# Altium schematic sheet Flex.SchDoc
size 431 x 279 mm; Organization: ORGANIZATION; Address1: ADDRESS 1; Address2: ADDRESS 2; Address3: ADDRESS 3; Address4: ADDRESS 4; Revision: -; ENG_APP_DATE: --/--/--; DSN_APP_DATE: --/--/--; CHK_APP_DATE: --/--/--
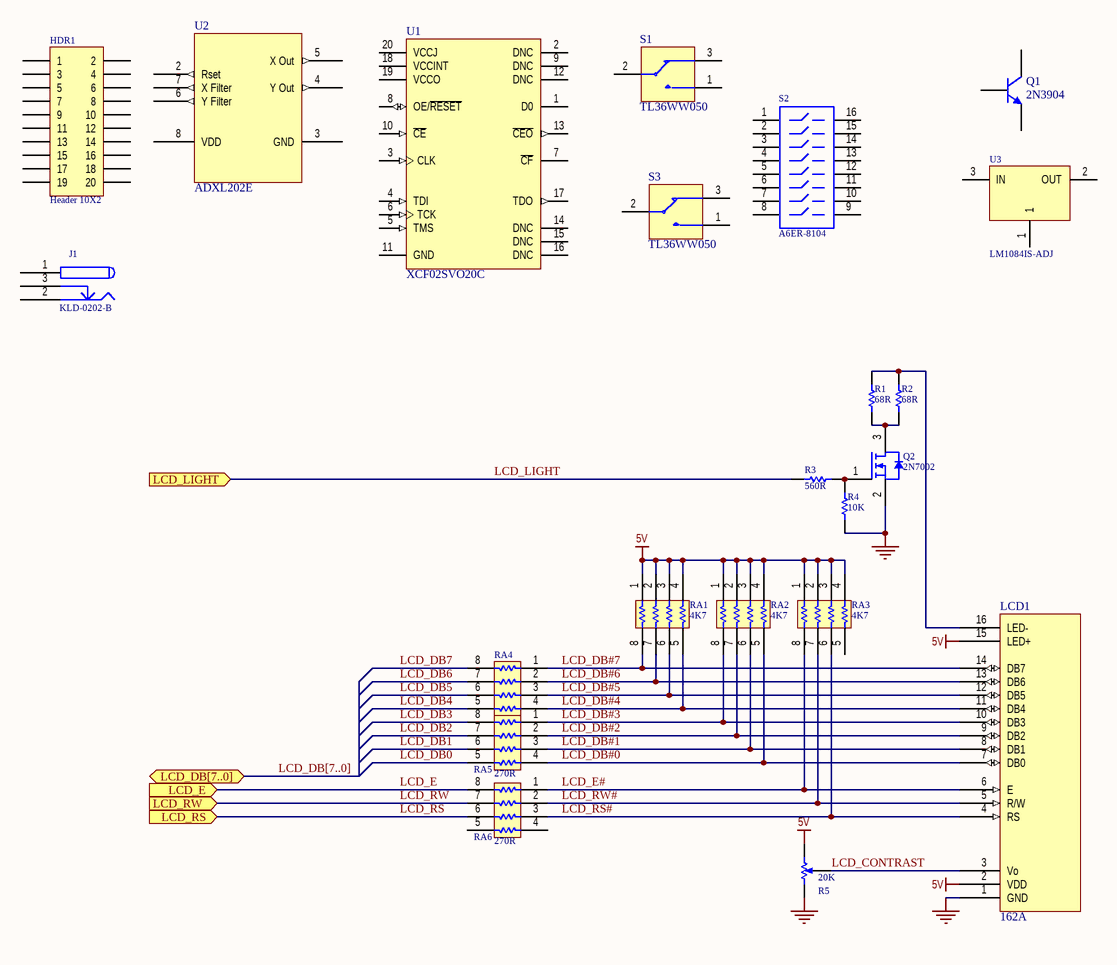
[diagram p0: Flex.SchDoc]

## Parts
HDR1  Header 10X2  [HDR2X10]
J1  KLD-0202-B  [KLD-0202]
LCD1  162A  [162A]
Q1  2N3904  [TO-92A]
Q2  2N7002  [SO-G3]
R1  68R  [CC2012-0805]
R2  68R  [CC2012-0805]
R3  560R  [CC2012-0805]
R4  10K  [CR2012-0805]
R5  20K  [POT4MM-2]
RA1  4K7  [MNR34T]
RA2  4K7  [MNR34T]
RA3  4K7  [MNR34T]
RA4  270R  [MNR34]
RA5  270R  [MNR34]
RA6  270R  [MNR34]
S1  TL36WW050  [PCB_SWITCH]
S2  A6ER-8104  [DIP-16-KEY]
S3  TL36WW050  [PCB_SWITCH]
U1  XCF02SVO20C  [VO20]
U2  ADXL202E  [E-8]
U3  LM1084IS-ADJ  [TO-263]

## Ports
LCD_DB[7..0] (bidir), LCD_E (in), LCD_LIGHT (in), LCD_RS (in), LCD_RW (in)

## Nets
5V: LCD1.2(VDD) LCD1.15(LED+) R5.CW(+) RA1.1 RA1.2 RA1.3 RA1.4 RA2.1 RA2.2 RA2.3 RA2.4 RA3.1 RA3.2 RA3.3 RA3.4
GND: LCD1.1(GND) Q2.2 R4.1 R5.CCW(-)
LCD_CONTRAST: LCD1.3(Vo) R5.W
LCD_DB0: RA5.5
LCD_DB1: RA5.6
LCD_DB2: RA5.7
LCD_DB3: RA5.8
LCD_DB4: RA4.5
LCD_DB5: RA4.6
LCD_DB6: RA4.7
LCD_DB7: RA4.8
LCD_DB#0: LCD1.7(DB0) RA2.5 RA5.4
LCD_DB#1: LCD1.8(DB1) RA2.6 RA5.3
LCD_DB#2: LCD1.9(DB2) RA2.7 RA5.2
LCD_DB#3: LCD1.10(DB3) RA2.8 RA5.1
LCD_DB#4: LCD1.11(DB4) RA1.5 RA4.4
LCD_DB#5: LCD1.12(DB5) RA1.6 RA4.3
LCD_DB#6: LCD1.13(DB6) RA1.7 RA4.2
LCD_DB#7: LCD1.14(DB7) RA1.8 RA4.1
LCD_E: RA6.8 ; port LCD_E
LCD_E#: LCD1.6(E) RA3.8 RA6.1
LCD_LIGHT: R3.1 ; port LCD_LIGHT
LCD_RS: RA6.6 ; port LCD_RS
LCD_RS#: LCD1.4(RS) RA3.6 RA6.3
LCD_RW: RA6.7 ; port LCD_RW
LCD_RW#: LCD1.5(R/W) RA3.7 RA6.2
NetLCD1_16: LCD1.16(LED-) R1.1 R2.1
NetQ2_1: Q2.1 R3.2 R4.2
NetQ2_3: Q2.3 R1.2 R2.2

Not connected (* = marked no-connect by the designer): HDR1 1 2 3 4 5 6 7 8 9 10 11 12 13 14 15 16 17 18 19 20; J1 1 2 3; Q1 1(E) 2(B) 3(C); RA3 5; RA6 4 5; S1 1 2 3; S2 1 2 3 4 5 6 7 8 9 10 11 12 13 14 15 16; S3 1 2 3; U1 1(D0) 2(DNC) 3(CLK) 4(TDI) 5(TMS) 6(TCK) 7(~{CF}) 8(OE/~{RESET}) 9(DNC) 10(~{CE}) 11(GND) 12(DNC) 13(~{CEO}) 14(DNC) 15(DNC) 16(DNC) 17(TDO) 18(VCCINT) 19(VCCO) 20(VCCJ); U2 1(Self_Test) 2(Rset) 3(GND) 4(Y_Out) 5(X_Out) 6(Y_Filter) 7(X_Filter) 8(VDD); U3 1 2(OUT) 3(IN)

## Buses and harness runs
bus LCD_DB[7..0] = port LCD_DB[7..0]

## Notes on the sheet
- 8
- 7
- 6
- 5
- 4
- 3
- DWG. NO.
- REV.
- SHT.
- 2
- 1
- THIS DOCUMENT AND THE DATA DISCLOSED HEREIN OR HEREWITH IS THE PROPERTY OF ALTIUM LIMITED AND MAY BE FREELY DISTRIBUTED IN WHOLE. NO RIGHTS ARE RESERVED OR EXPRESS OR IMPLIED WARANTEE GIVEN.
- REVISION
- DESCRIPTION
- DATE
- APPROVED
- F
- E
- D
- C
- B
- ENG:
- APPROVALS
- PROJECT
- A
- DSN:
- CHK:
- REFERENCE DOCUMENTS
- PROJECT REVISION:
- TITLE
- DOCUMENT REVISION:
- DESIGN ITEM:
- BOM:
- FAB DWG:
- PCB DWG:
- ASSY DWG:
- SCALE:
- SIZE
- CAGE CODE
- FILE NAME
- DWG NO.
- SHEET
- OF
- REV

## Library data of the parts
HDR1 = Header 10X2: Header, 10-Pin, Dual row; Revision: July-2002: Re-released for DXP Platform.
J1 = KLD-0202-B: Low Voltage Power Supply Connector; Manufacturer: Kycon; AEMS Code: 3510211
LCD1 = 162A: 16 char * 2 line LCD character display with b/light
Q1 = 2N3904: NPN General Purpose Amplifier; Published: 8-Jun-2000; LatestRevisionDate: 15-Jan-2003; LatestRevisionNote: PCB Footprint 'BCY-W3/D4.7' replaced; DatasheetVersion: 1997; PackageVersion: Sep-1998; PackageReference: TO-92A; Publisher: Altium Limited; PackageDescription: TO, Flat Index; 3 In-Line, Axial Leads; Body Dia. 4.5mm; Leads 0.51 x 0.48 mm (max); ComponentLink1Description: Manufacturer Link; ComponentLink1URL: http://www.fairchildsemi.com/; ComponentLink2Description: Datasheet; ComponentLink2URL: http://www.fairchildsemi.com/ds/2N%2F2N3904.pdf
Q2 = 2N7002: N Channel Mosfet
R1 R2 = RES_2: Resistor; AEMS Code: 1200821
R3 = RES: Resistor; AEMS Code: 1200723
R4 = RES: Resistor; AEMS Code: 1200006JT
R5 = RPot SM: Square Trimming Potentiometer; AEMS Code: 1400226
RA1-RA3 = MNR34: 3216x4 Resistor Array; AEMS Code: 1300330
RA4-RA6 = MNR34: 3216x4 Resistor Array; AEMS Code: 1310010
S1 S3 = PCB_MOUNT_SWITCH: SPDT Subminiature Toggle Switch; Supplier: FARNELL; Supplier Code: 150-559
S2 = A6ER-8104: DIP Switch Side actuator long liver Piano Key; Revision: July-2002: Re-released for DXP Platform.
U1 = XCF02SVO20C: XCF00S Series, Platform Flash In-System Programmable Configuration 3.3V PROM, 20-Pin TSOP, 2-Megabit, Commercial Grade; PackageDocument: ver1.0, May-2003; AEMS Code: CHANGED VALUE; DatasheetDocument: ver2.3, May-2004; PackageReference: VO20; Code_JEDEC: MO-153-AC
U2 = ADXL202E: Accelerometer with Digital Output
U3 = LM1084IS-ADJ: 5A Low Dropout Possitive Regulators